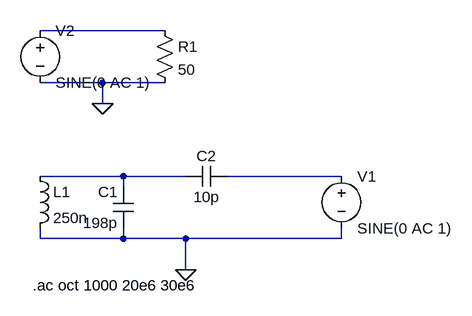
[diagram p0: schematic Probe_Sim.asc]
Probe_Sim.asc, the LTspice schematic file:
Version 4
SHEET 1 880 680
WIRE 224 -112 32 -112
WIRE 128 -32 32 -32
WIRE 224 -32 128 -32
WIRE 128 0 128 -32
WIRE 160 112 32 112
WIRE 256 112 160 112
WIRE 496 112 320 112
WIRE 160 128 160 112
WIRE 32 208 32 192
WIRE 160 208 160 192
WIRE 160 208 32 208
WIRE 256 208 160 208
WIRE 496 208 496 192
WIRE 496 208 256 208
WIRE 256 256 256 208
FLAG 256 256 0
FLAG 128 0 0
SYMBOL ind 16 96 R0
SYMATTR InstName L1
SYMATTR Value 250n
SYMBOL cap 176 192 R180
WINDOW 0 24 56 Left 2
WINDOW 3 24 8 Left 2
SYMATTR InstName C1
SYMATTR Value 198p
SYMBOL cap 320 96 R90
WINDOW 0 0 32 VBottom 2
WINDOW 3 32 32 VTop 2
SYMATTR InstName C2
SYMATTR Value 10p
SYMBOL voltage 496 96 R0
WINDOW 123 0 0 Left 0
WINDOW 39 0 0 Left 0
SYMATTR InstName V1
SYMATTR Value SINE(0 AC 1)
SYMBOL voltage 32 -128 R0
WINDOW 123 0 0 Left 0
WINDOW 39 0 0 Left 0
SYMATTR InstName V2
SYMATTR Value SINE(0 AC 1)
SYMBOL res 208 -128 R0
SYMATTR InstName R1
SYMATTR Value 50
TEXT 20 280 Left 2 !.ac oct 1000 20e6 30e6

The netlist it stands for:
* Probe_Sim.asc
L1 N002 0 250n
C1 0 N002 198p
C2 N003 N002 10p
V1 N003 0 SINE(0 AC 1)
V2 N001 0 SINE(0 AC 1)
R1 N001 0 50
.ac oct 1000 20e6 30e6
.backanno
.end